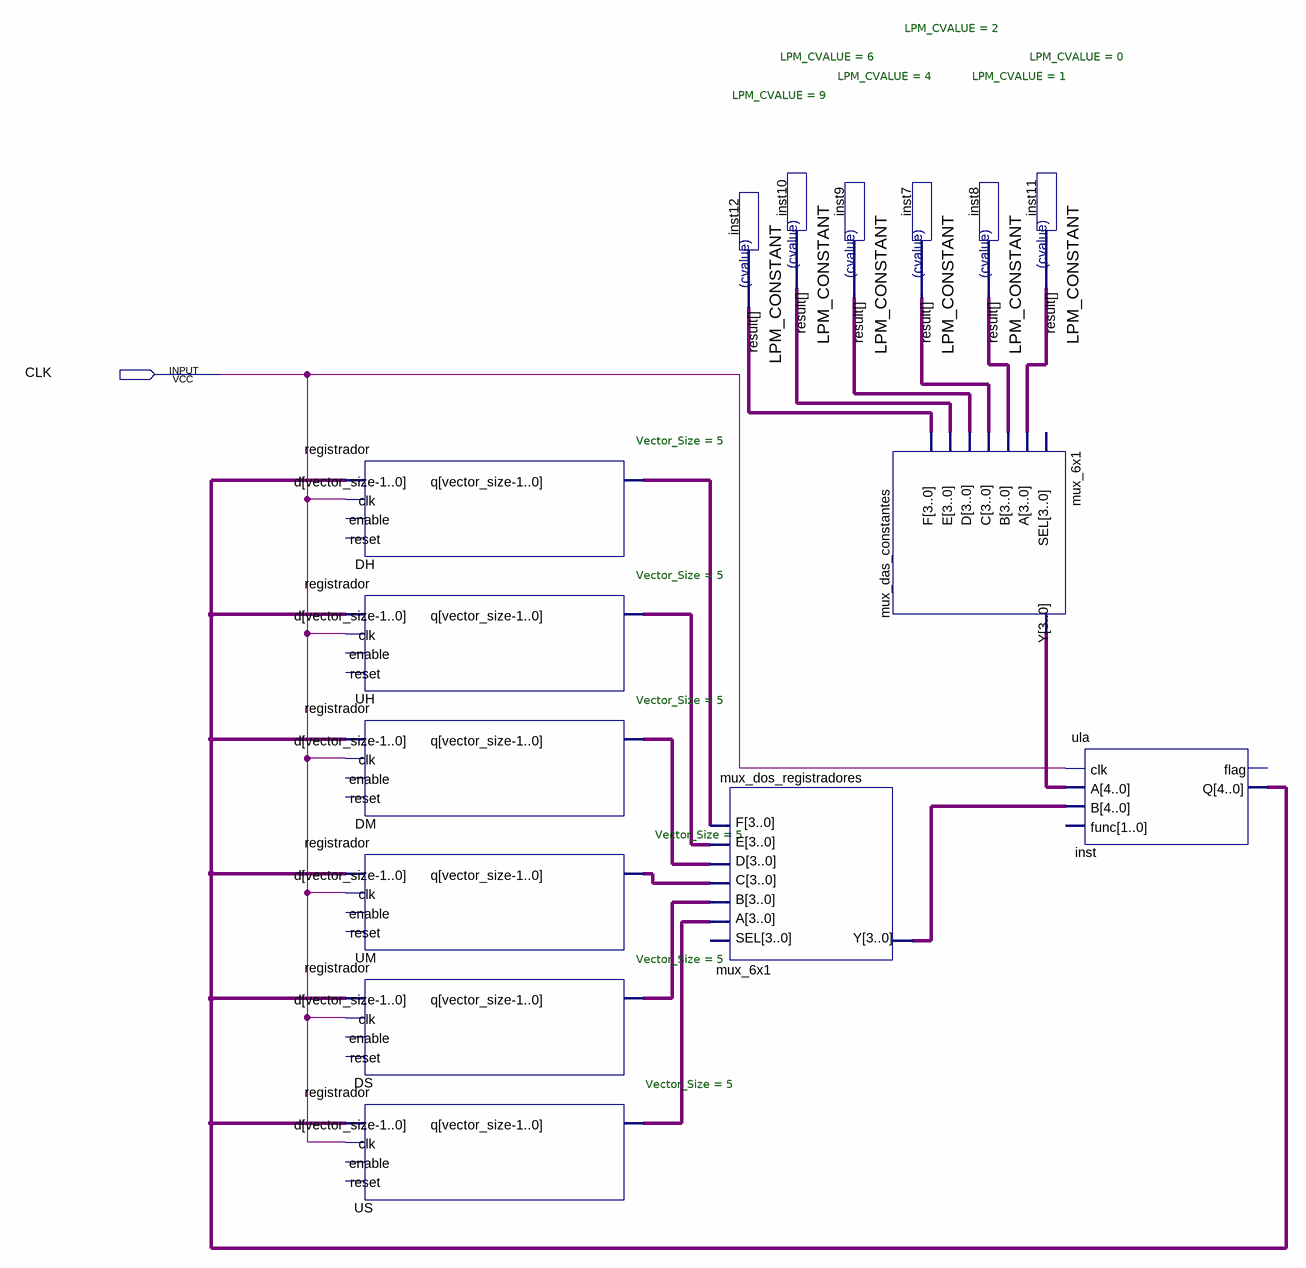
[diagram p0: schematic sheet]
// Quartus schematic Block1.bdf as structural Verilog: 15 symbols, 1 pins
module Block1 (
  input  CLK
);

  wire [3:0] inst7_result, inst8_result, inst9_result, inst10_result, inst11_result, inst12_result;
  wire [4:0] DH_q, DM_q, DS_q, inst_q, mux_das_constantes_y, mux_dos_registradores_y, UH_q, UM_q, US_q;

  registrador #(.Vector_Size(5)) DH (.d(inst_q), .clk(CLK), .q(DH_q));  // open: enable, reset
  registrador #(.Vector_Size(5)) UH (.d(inst_q), .clk(CLK), .q(UH_q));  // open: enable, reset
  registrador #(.Vector_Size(5)) DM (.d(inst_q), .clk(CLK), .q(DM_q));  // open: enable, reset
  registrador #(.Vector_Size(5)) UM (.d(inst_q), .clk(CLK), .q(UM_q));  // open: enable, reset
  registrador #(.Vector_Size(5)) DS (.d(inst_q), .clk(CLK), .q(DS_q));  // open: enable, reset
  registrador #(.Vector_Size(5)) US (.d(inst_q), .clk(CLK), .q(US_q));  // open: enable, reset
  LPM_CONSTANT #(.LPM_CVALUE(9)) inst12 (.result(inst12_result));
  mux_6x1 mux_dos_registradores (
    .A(US_q), .B(DS_q), .C(UM_q), .D(DM_q), .E(UH_q), .F(DH_q), .Y(mux_dos_registradores_y));  // open: SEL
  LPM_CONSTANT #(.LPM_CVALUE(6)) inst10 (.result(inst10_result));
  LPM_CONSTANT #(.LPM_CVALUE(4)) inst9 (.result(inst9_result));
  LPM_CONSTANT #(.LPM_CVALUE(2)) inst7 (.result(inst7_result));
  mux_6x1 mux_das_constantes (
    .A(inst11_result), .B(inst8_result), .C(inst7_result), .D(inst9_result), .E(inst10_result),
    .F(inst12_result), .Y(mux_das_constantes_y));  // open: SEL
  LPM_CONSTANT #(.LPM_CVALUE(1)) inst8 (.result(inst8_result));
  LPM_CONSTANT #(.LPM_CVALUE(0)) inst11 (.result(inst11_result));
  ula inst (.clk(CLK), .A(mux_das_constantes_y), .B(mux_dos_registradores_y), .Q(inst_q));  // open: func, flag
endmodule
